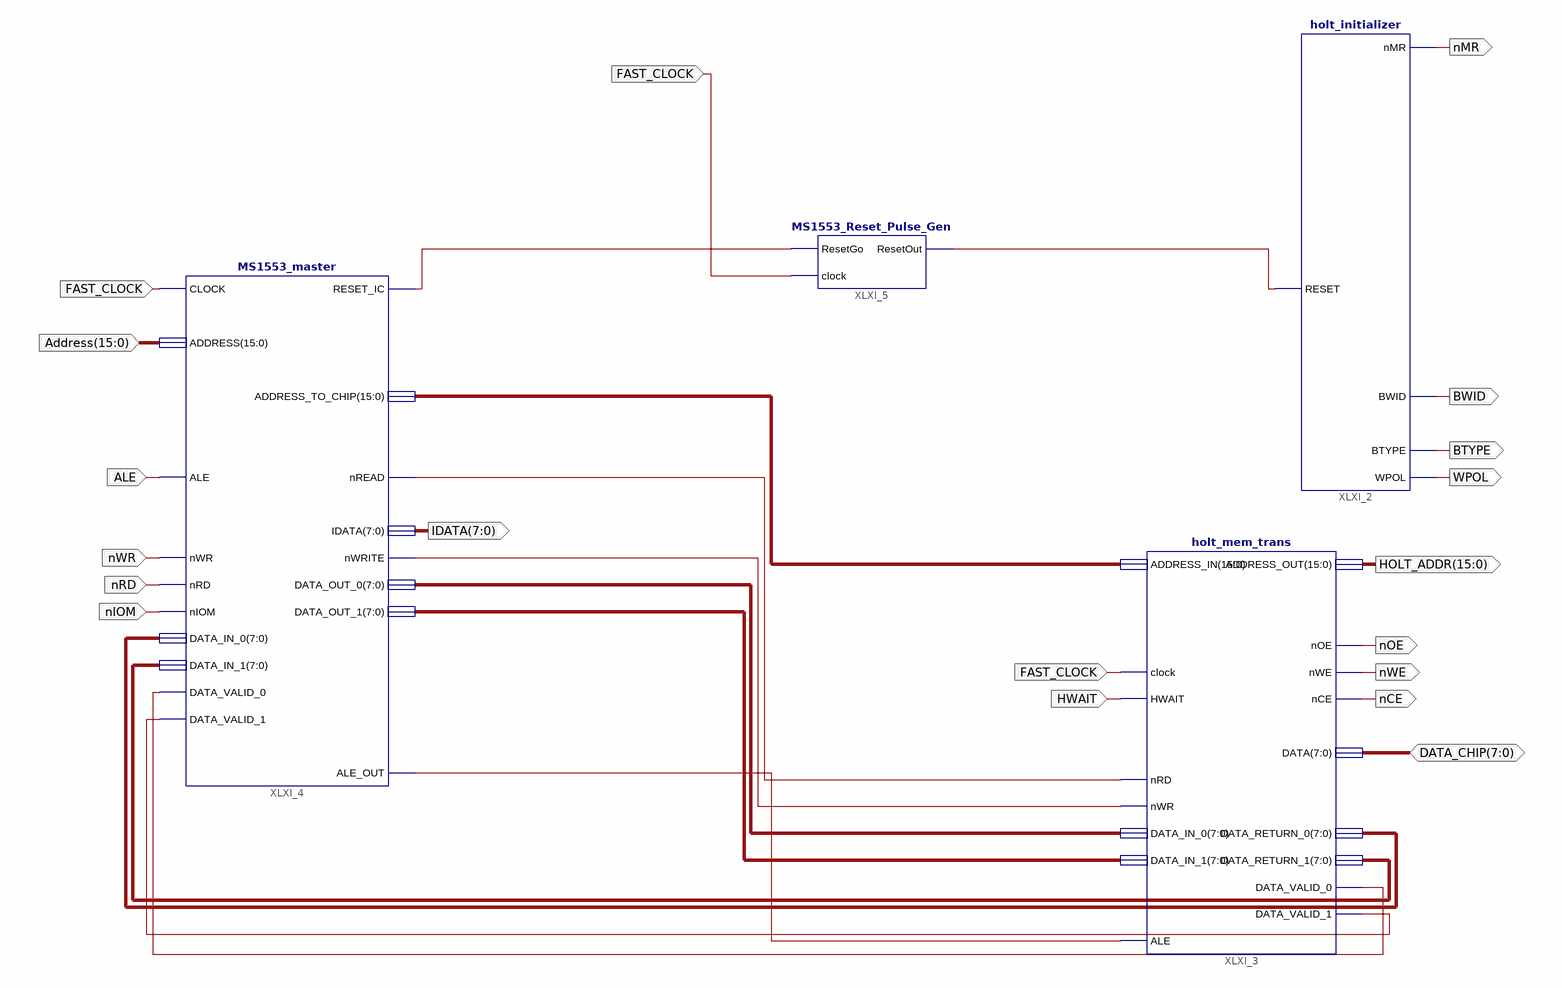
[diagram p0: schematic sheet 1]
// Xilinx ISE schematic MS1553_Controller.sch (spartan6) as structural Verilog: 4 symbols, 17 ports
module MS1553_Controller (
  input  [15:0] Address,
  input  FAST_CLOCK,
  input  ALE,
  input  nWR,
  input  nRD,
  input  nIOM,
  input  HWAIT,
  inout  [7:0] DATA_CHIP,
  output nMR,
  output BWID,
  output BTYPE,
  output WPOL,
  output [7:0] IDATA,
  output nCE,
  output nWE,
  output nOE,
  output [15:0] HOLT_ADDR
);

  wire XLXN_1, XLXN_2, XLXN_11, XLXN_12, XLXN_19, XLXN_20, XLXN_21;
  wire [7:0] XLXN_13, XLXN_14, XLXN_15, XLXN_16;
  wire [15:0] XLXN_17;

  holt_initializer XLXI_2 (.RESET(XLXN_2), .nMR(nMR), .BWID(BWID), .BTYPE(BTYPE), .WPOL(WPOL));
  holt_mem_trans XLXI_3 (
    .nRD(XLXN_11), .nWR(XLXN_12), .clock(FAST_CLOCK), .HWAIT(HWAIT), .ADDRESS_IN(XLXN_17),
    .DATA_IN_0(XLXN_13), .DATA_IN_1(XLXN_14), .DATA(DATA_CHIP), .nOE(nOE), .nWE(nWE), .nCE(nCE),
    .DATA_VALID_0(XLXN_19), .DATA_VALID_1(XLXN_20), .ADDRESS_OUT(HOLT_ADDR), .DATA_RETURN_0(XLXN_15),
    .DATA_RETURN_1(XLXN_16), .ALE(XLXN_21));
  MS1553_master XLXI_4 (
    .ALE(ALE), .nWR(nWR), .nRD(nRD), .nIOM(nIOM), .CLOCK(FAST_CLOCK), .DATA_VALID_0(XLXN_19),
    .DATA_VALID_1(XLXN_20), .ADDRESS(Address), .DATA_IN_0(XLXN_15), .DATA_IN_1(XLXN_16), .nREAD(XLXN_11),
    .nWRITE(XLXN_12), .RESET_IC(XLXN_1), .ADDRESS_TO_CHIP(XLXN_17), .DATA_OUT_0(XLXN_13),
    .DATA_OUT_1(XLXN_14), .IDATA(IDATA), .ALE_OUT(XLXN_21));
  MS1553_Reset_Pulse_Gen XLXI_5 (.ResetGo(XLXN_1), .clock(FAST_CLOCK), .ResetOut(XLXN_2));
endmodule
